# Altium schematic sheet GPS_WS_NEO7M.SchDoc
size 420 x 297 mm; Author: Шафиев Р. И.; CompanyName: HSE; SheetNumber: 1; SheetTotal: 1
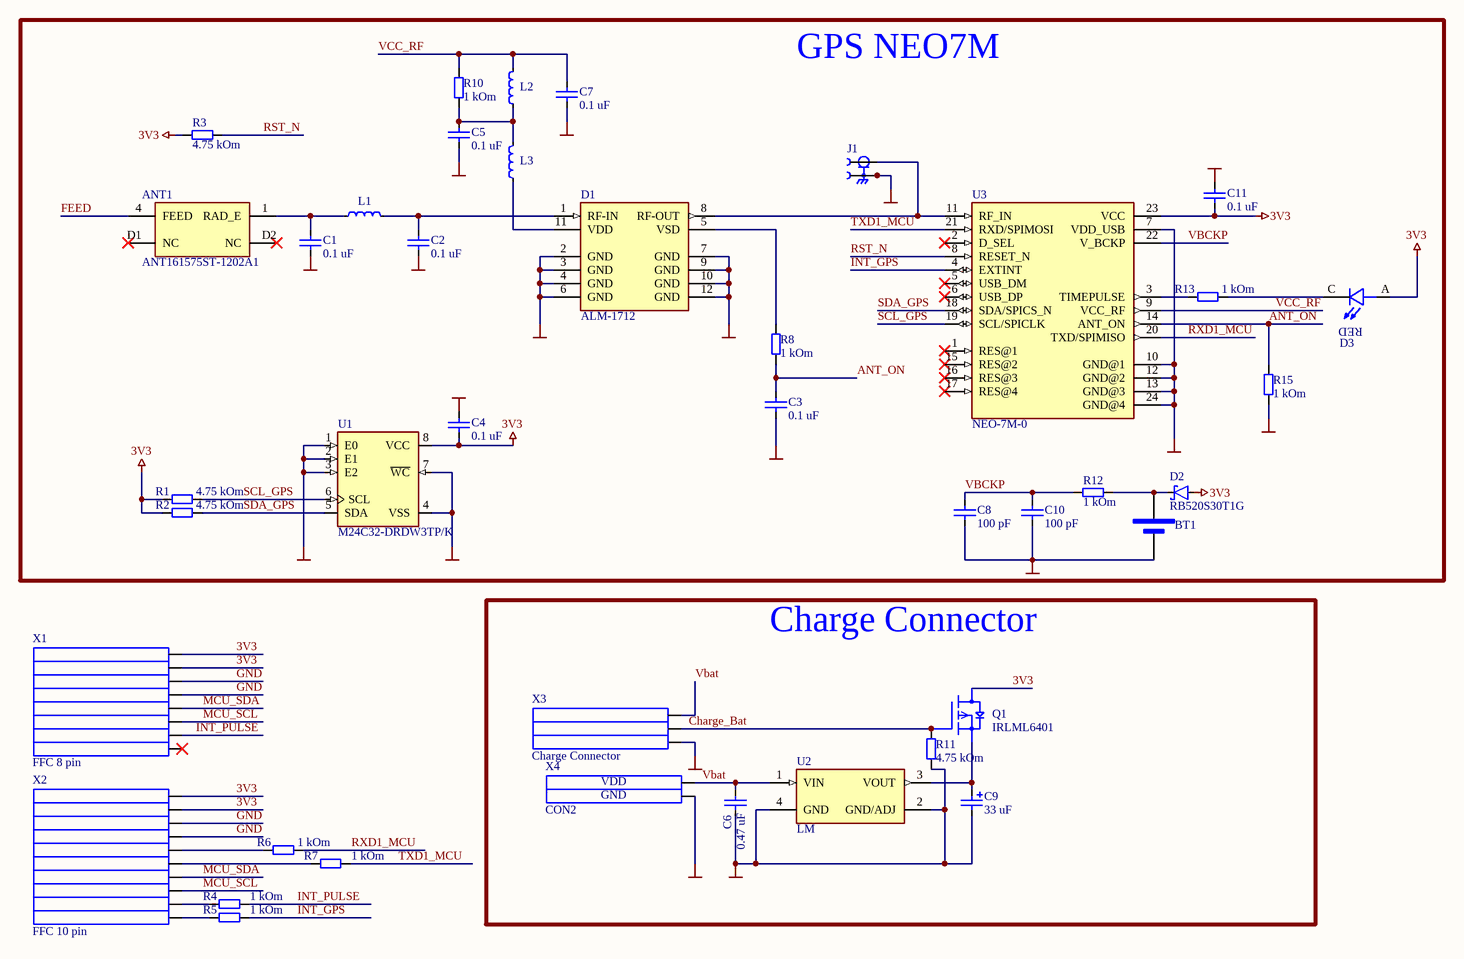
[diagram p0: GPS_WS_NEO7M.SchDoc]

## Parts
ANT1  ANT161575ST-1202A1  [ANT161575ST1202A1]
BT1  ML414H_IV01E  [SEIKO_ML414H_IV01E]  (value not drawn)
C1  value 0.1 uF  [CAPC1005X55N]  (hidden comment: STD_CAP)
C2  value 0.1 uF  [CAPC1005X55N]  (hidden comment: STD_CAP)
C3  value 0.1 uF  [CAPC1005X55N]  (hidden comment: STD_CAP)
C4  value 0.1 uF  [CAPC1005X55N]  (hidden comment: STD_CAP)
C5  value 0.1 uF  [CAPC1005X55N]  (hidden comment: STD_CAP)
C6  value 0.47 uF  [CAPC1608X90N]  (hidden comment: STD_CAP)
C7  value 0.1 uF  [CAPC1608X90N]  (hidden comment: STD_CAP)
C8  value 100 pF  [CAPC1005X55N]  (hidden comment: STD_CAP)
C9  value 33 uF  [CAPMP3216X180N]  (hidden comment: STD_CAP_POL)
C10  value 100 pF  [CAPC1005X55N]  (hidden comment: STD_CAP)
C11  value 0.1 uF  [CAPC1005X55N]  (hidden comment: STD_CAP)
D1  ALM-1712  [ALM-1712]
D2  RB520S30T1G  [SOD523]
D3  7012X1  [LED_7012X1]  (value not drawn)
J1  CONUFL001-SMD  [LINX_CONUFL001-SMD]  (value not drawn)
L1  STD_IND  [RESC1005X40N]  (value not drawn)
L2  STD_IND  [RESC1005X40N]  (value not drawn)
L3  STD_IND  [RESC1005X40N]  (value not drawn)
Q1  IRLML6401  [SOT23]
R1  value 4.75 kOm  [RESC1005X40N]  (hidden comment: 2904)
R2  value 4.75 kOm  [RESC1005X40N]  (hidden comment: 2904)
R3  value 4.75 kOm  [RESC1005X40N]  (hidden comment: 2904)
R4  value 1 kOm  [RESC1005X40N]  (hidden comment: 2839)
R5  value 1 kOm  [RESC1005X40N]  (hidden comment: 2839)
R6  value 1 kOm  [RESC1005X40N]  (hidden comment: 2839)
R7  value 1 kOm  [RESC1005X40N]  (hidden comment: 2839)
R8  value 1 kOm  [RESC1005X40N]  (hidden comment: 2839)
R10  value 1 kOm  [RESC1005X40N]  (hidden comment: 2839)
R11  value 4.75 kOm  [RESC1005X40N]  (hidden comment: 2904)
R12  value 1 kOm  [RESC1005X40N]  (hidden comment: 2839)
R13  value 1 kOm  [RESC1005X40N]  (hidden comment: 2839)
R15  value 1 kOm  [RESC1005X40N]  (hidden comment: 2839)
U1  M24C32-DRDW3TP/K  [SOP65P640X120-8N]
U2  LM  [SOT229P700X180-4N]
U3  NEO-7M-0  [XCVR_NEO-7M-0]
X1  FFC 8 pin  [Charge Connector]
X2  FFC 10 pin  [SAMTEC_ZF5S-10-01-T-WT]
X3  Charge Connector  [POGO PINS]
X4  CON2  [CON2]

## Blocks framed on the sheet
GPS NEO7M: ANT1 BT1 C1-C5 C7 C8 C10 C11 D1-D3 J1 L1-L3 R1-R3 R8 R10 R12 R13 R15 U1 U3
Charge Connector: C6 C9 Q1 R11 U2 X3 X4

## Nets
3V3: C4.2 C11.2 D2.2(A) D3.A Q1.3(D) R1.1 R2.1 R3.2 U1.8(VCC) U3.23(VCC) X1.1 X1.2 X2.1 X2.2
GND: BT1.2(NEG) C1.2 C2.2 C3.2 C4.1 C5.2 C6.2 C7.2 C8.2 C9.2 C10.2 C11.1 D1.2(GND) D1.3(GND) D1.4(GND) D1.6(GND) D1.7(GND) D1.9(GND) D1.10(GND) D1.12(GND) J1.2 J1.3 R11.1 R15.2 U1.1(E0) U1.2(E1) U1.3(E2) U1.4(VSS) U1.7(~{WC}) U2.2(GND/ADJ) U2.4(GND) U3.7(VDD_USB) U3.10(GND@1) U3.12(GND@2) U3.13(GND@3) U3.24(GND@4) X1.3 X1.4 X2.3 X2.4 X3.3 X4.2
ANT_ON: C3.1 R8.2 R15.1 U3.14(ANT_ON)
Charge_Bat: Q1.1(G) R11.2 X3.2
FEED: ANT1.4(FEED)
INT_GPS: R5.2 U3.4(EXTINT)
INT_PULSE: R4.2 X1.7
MCU_SCL: X1.6 X2.8
MCU_SDA: X1.5 X2.7
RST_N: R3.1 U3.8(RESET_N)
RXD1_MCU: R6.1 U3.20(TXD/SPIMISO)
SCL_GPS: R1.2 U1.6(SCL) U3.19(SCL/SPICLK)
SDA_GPS: R2.2 U1.5(SDA) U3.18(SDA/SPICS_N)
TXD1_MCU: R7.2 U3.21(RXD/SPIMOSI)
Vbat: C6.1 U2.1(VIN) X3.1 X4.1
VBCKP: C8.1 C10.1 R12.2 U3.22(V_BCKP)
VCC_RF: C7.1 L2.2 R10.1 U3.9(VCC_RF)
NetANT1_1: ANT1.1(RAD_E) C1.1 L1.1
NetBT1_1: BT1.1(POS) D2.1(K) R12.1
NetC2_1: C2.1 D1.1(RF-IN) L1.2
NetC5_1: C5.1 L2.1 L3.2 R10.2
NetC9_1: C9.1 Q1.2(S) U2.3(VOUT)
NetD1_5: D1.5(VSD) R8.1
NetD1_8: D1.8(RF-OUT) J1.1 U3.11(RF_IN)
NetD1_11: D1.11(VDD) L3.1
NetD3_C: D3.C R13.1
NetR4_1: R4.1 X2.9
NetR5_1: R5.1 X2.10
NetR6_2: R6.2 X2.5
NetR7_1: R7.1 X2.6
NetR13_2: R13.2 U3.3(TIMEPULSE)

Not connected (* = marked no-connect by the designer): ANT1 D1(NC)* D2(NC)*; U3 1(RES@1)* 2(D_SEL)* 5(USB_DM)* 6(USB_DP)* 15(RES@2)* 16(RES@3)* 17(RES@4)*; X1 8*

## Notes on the sheet
- VDD
- GND
- Перв. примен.
- Справ. №
- Подп. и дата
- Инв. № дубл.
- Взам. инв. №
- Изм.
- Лист
- № докум.
- Подп.
- Дата
- Лит.
- Масса
- Масштаб
- Т.контр.
- Разраб.
- Пров.
- Листов
- Инв. № подл.
- Н.контр.
- ООО "Т8 НТЦ"
- Утв.
- Копировал
- Формат А3
- (in symbol 7012X1) RED

## Library data of the parts
ANT1 = ANT161575ST-1202A1: ManufacturerPartnumber: AMAN1003030ST01; Manufacturer: AMOTECH; BOM: GPS Antenna    AMAN1003030ST01 AMOTECH; Human_Readable: GPS Antenna; Footprint_Description: Custom
BT1 = ML414H_IV01E: Coin, 4.8mm 3 V Lithium Battery Rechargeable (Secondary) 1mAh; MP: ML414H IV01E; MF: Seiko Instruments; Human_Readable: Перезаряжаемая батарейка; BOM: Перезаряжаемая батарейка    ML414H IV01E Seiko Instruments; Price: None; Purchase-URL: https://pricing.snapeda.com/search/part/ML414H IV01E/?ref=eda; Package: SOT-89 Seiko; Check_prices: https://www.snapeda.com/parts/ML414H%20IV01E/Seiko+Instruments/view-part/?ref=eda; Value: *; Availability: In Stock; ManufacturerPartnumber: ML414H IV01E; Manufacturer: Seiko Instruments; Footprint_Description: SOT-89 Seiko
C1-C3 C5 = 5571: ManufacturerPartnumber: GRM155R71H104KE14D; Manufacturer: muRata; Number_Base: 5571; Comp_ID: 200003-430; Lib_Description: Capacitor; Comp_Description: Capacitors 0402 0.10 uF ±10% 50V X7R; Human_Readable: Конденсатор 0402 0.1 uF ±10% 50V X7R; Precision: 10%; Temp_Range: -55°C to +125°C; Voltage_Range: 50V; Comp_Class_Number: 200003; Comp_Class_Name: Capacitors Chip SMD 0402; AuthorCreation_Comp: altium_lib_sch_p; AuthorModification_Comp: anosova; BOM: Конденсатор 0402 0.1 uF ±10% 50V X7R    GRM155R71H104KE14D muRata; Dielectric: X7R; HelpURL: \\corp1\RNDlibrary\_Library\Altium_lib\Datasheet\muRata\Chip_Monolithic_Ceramic_Capacitors\c02e.pdf; ComponentLink1Description: MANUFACTURER_URL; ComponentLink1URL: https://www.murata.com/~/media/webrenewal/support/library/catalog/products/capacitor/mlcc/c02e.ashx; Verified: N; TimeCreation_Comp: 05.04.2018 11:21:57; TimeModification_Comp: 18.11.2021 13:11:41; Footprint_Description: Chip Capacitor EIA 0402. METRIC 1005, 2-Leads, Body 1,00x0,5mm, IPC Medium Density
C4 C11 = 5571: ManufacturerPartnumber: GRM155R71H104KE14D; Manufacturer: muRata; Number_Base: 5571; Comp_ID: 200003-430; Lib_Description: Capacitor; Comp_Description: Capacitors 0402 0.10 uF ±10% 50V X7R; Human_Readable: Конденсатор 0402 0.1 uF ±10% 50V X7R; Precision: 10%; Temp_Range: -55°C to +125°C; Voltage_Range: 50V; Dielectric: X7R; Comp_Class_Number: 200003; Comp_Class_Name: Capacitors Chip SMD 0402; AuthorCreation_Comp: altium_lib_sch_p; AuthorModification_Comp: anosova; BOM: Конденсатор 0402 0.1 uF ±10% 50V X7R    GRM155R71H104KE14D muRata; Footprint_Description: Chip Capacitor EIA 0402. METRIC 1005, 2-Leads, Body 1,00x0,5mm, IPC Medium Density; HelpURL: \\corp1\RNDlibrary\_Library\Altium_lib\Datasheet\muRata\Chip_Monolithic_Ceramic_Capacitors\c02e.pdf; ComponentLink1Description: MANUFACTURER_URL; ComponentLink1URL: https://www.murata.com/~/media/webrenewal/support/library/catalog/products/capacitor/mlcc/c02e.ashx; Verified: N; TimeCreation_Comp: 05.04.2018 11:21:57; TimeModification_Comp: 18.11.2021 13:11:41
C6 = 3938: ManufacturerPartnumber: GRM188R71A474KA61D; Manufacturer: muRata; Number_Base: 3938; Comp_ID: 200004-0111; Lib_Description: Capacitor; Comp_Description: Capacitors 0603 0.47 uF ±10% 10V X7R; Human_Readable: Конденсатор 0603 0.47 uF ±10% 10V X7R; Precision: ±10%; Temp_Range: -55 to 125°C; Voltage_Range: 10V; Dielectric: X7R; Comp_Class_Number: 200004; Comp_Class_Name: Capacitors Chip SMD 0603; BOM: Конденсатор 0603 0.47 uF ±10% 10V X7R    GRM188R71A474KA61D muRata; Footprint_Description: Chip Capacitor EIA 0603. METRIC 1608, 2-Leads, Body 1,6x0,8mm, IPC Medium Density; HelpURL: \\corp1\RNDlibrary\_Library\Altium_lib\Datasheet\muRata\Chip_Monolithic_Ceramic_Capacitors\Chip_Monolithic_Ceramic_Capacitors.pdf; ComponentLink1Description: MANUFACTURER_URL; ComponentLink1URL: http://www.murata.com/products/catalog/pdf/c02e.pdf; TimeModification_Comp: 06.12.2011 14:46:17
C7 = 6202: ManufacturerPartnumber: C1608X7R1H104K; Manufacturer: TDK; Number_Base: 6202; Comp_ID: 200004-122; Lib_Description: Capacitor; Comp_Description: Capacitors 0603 0.1 uF ±10% 50V X7R; Precision: ± 10%; Temp_Range: -55°C to +125°C; Voltage_Range: 50 V; Dielectric: X7R; Comp_Class_Number: 200004; Comp_Class_Name: Capacitors Chip SMD 0603; AuthorCreation_Comp: anosova; BOM: Capacitors 0603 0.1 uF ±10% 50V X7R    C1608X7R1H104K TDK; Footprint_Description: Chip Capacitor EIA 0603. METRIC 1608, 2-Leads, Body 1,60x0,8mm, IPC Medium Density; Human_Readable: Capacitors 0603 0.1 uF ±10% 50V X7R; HelpURL: \\corp1\RNDlibrary\_Library\Altium_lib\Datasheet\TDK\Ceramic_Capacitors_C-Series\cseries.pdf; ComponentLink1Description: MANUFACTURER_URL; ComponentLink1URL: https://media.digikey.com/pdf/Data%20Sheets/TDK%20PDFs/C_Series_GeneralAppl_B11.pdf; Verified: N; TimeCreation_Comp: 29.10.2021 11:15:01; AuthorModification_Comp: anosova; TimeModification_Comp: 29.10.2021 11:29:43
C8 C10 = 3764: ManufacturerPartnumber: GRM1555C1H101JA01D; Manufacturer: muRata; Number_Base: 3764; Comp_ID: 200003-0363; Lib_Description: Capacitor; Comp_Description: Capacitors 0402 100 pF ±5% 50V  C0G (NP0); Human_Readable: Конденсатор 0402 100 pF ±5% 50V  C0G (NP0); Precision: ±5%; Temp_Range: 25 to 125°C; Voltage_Range: 50V; Dielectric: C0G (NP0); Comp_Class_Number: 200003; Comp_Class_Name: Capacitors Chip SMD 0402; BOM: Конденсатор 0402 100 pF ±5% 50V  C0G (NP0)    GRM1555C1H101JA01D muRata; AuthorModification_Comp: anosova; Footprint_Description: Chip Capacitor EIA 0402. METRIC 1005, 2-Leads, Body 1,00x0,5mm, IPC Medium Density; HelpURL: \\corp1\RNDlibrary\_Library\Altium_lib\Datasheet\muRata\Chip_Monolithic_Ceramic_Capacitors\Chip_Monolithic_Ceramic_Capacitors.pdf; ComponentLink1Description: MANUFACTURER_URL; ComponentLink1URL: http://www.murata.com/products/catalog/pdf/c02e.pdf; TimeModification_Comp: 18.11.2021 12:51:58; Price: 0,0599999986588955
C9 = 4456: ManufacturerPartnumber: T491A336K010AT; Manufacturer: Kemet; Number_Base: 4456; Comp_ID: 2010-0363; Lib_Description: Polar Capacitor; Comp_Description: Tantal Capacitor Case A  METRIC 3216-18   33 uF 10% 10V; Human_Readable: Конденсатор танталовый корпус A  METRIC 3216-18   33 uF 10% 10V; Precision: 10%; Temp_Range: -55°C to +125°C; Voltage_Range: 10V; Comp_Class_Number: 2010; Comp_Class_Name: Capacitors Tantal; BOM: Конденсатор танталовый корпус A  METRIC 3216-18   33 uF 10% 10V    T491A336K010AT Kemet; Footprint_Description: Tantal Capacitor,Case A, METRIC 3216-18. 2-Leads, Body 3.2x1.6mm, IPC Medium Density; HelpURL: \\corp1\RNDlibrary\_Library\Altium_lib\Datasheet\KEMET\T491\KEM_TC101_STD.pdf; ComponentLink1Description: MANUFACTURER_URL; ComponentLink1URL: http://www.kemet.com/kemet/web/homepage/kechome.nsf/weben/9F2DE33590D9247E8525788D0059B1E1/$file/KEM_TC101_STD.pdf; TimeModification_Comp: 08.12.2011 13:13:16
D1 = ALM-1712: Sot223/Pkg 1-Amp 3.3-Volt Low Drop Out Voltage Regulatator; MF: Advanced Monolithic Systems; MP: AMS1117-3.3; Price: None; Value: *; Availability: Not in stock; Package: SOT-223 Seeed Technology; Check_prices: https://www.snapeda.com/parts/AMS1117-3.3/Advanced+Monolithic+Systems/view-part/?ref=eda; SnapEDA_Link: https://www.snapeda.com/parts/AMS1117-3.3/Advanced+Monolithic+Systems/view-part/?ref=snap
D2 = RB520S30T1G: Diode Schottky 30 V 200mA (DC) Surface Mount SOD-523; Manufacturer: NXP Semiconductors; MP: 1PS79SB70; Human_Readable: Diode Schotky; BOM: Diode Schotky    1PS79SB70 NXP Semiconductors; Package: None; Price: None; Value: *; ManufacturerPartnumber: 1PS79SB70; Footprint_Description: SOD523
D3 = 7012X1: Red - LED Indication - Discrete 1.7V 0805 (2012 Metric); MF: VCC; Package: 0805 Visual Communications; Purchase-URL: https://pricing.snapeda.com/search/part/7012X1/?ref=eda; MP: 7012X1; Value: *; Availability: In Stock; SnapEDA_Link: https://www.snapeda.com/parts/7012X1/Visual+Communications/view-part/?ref=snap; Price: None; Check_prices: https://www.snapeda.com/parts/7012X1/Visual+Communications/view-part/?ref=eda
J1 = CONUFL001-SMD: Manufacturer: TE Connectivity; ManufacturerPartnumber: 1909763-1; BOM: UMCC разъем    1909763-1 TE Connectivity; Human_Readable: UMCC разъем; Availability: In Stock; Price: None; SnapEDA_Link: https://www.snapeda.com/parts/CONUFL001-SMD/Linx/view-part/5842340/?ref=snap; Value: *; Check_prices: https://www.snapeda.com/parts/CONUFL001-SMD/Linx/view-part/5842340/?ref=eda; Package: None; Footprint_Description: UMCC; Parameter 4: *; Parameter 5: *
L1-L3 = 5343: ManufacturerPartnumber: LQW15AN24NG00; Manufacturer: muRata; Value: 24 nH; Number_Base: 5343; Comp_ID: 13010000-030; Lib_Description: RF Inductor wire wound 0402 Size; Precision: ±2%; Temp_Range: -55°C to +125°C; Current_Range: 280 mA; Comp_Class_Number: 13010000; Comp_Class_Name: Inductances Chip; AuthorCreation_Comp: altium_lib_sch_p; BOM: RF Inductor wire wound 0402 Size    LQW15AN24NG00 muRata; Price: 0,239999994635582; Comp_Description: RF Inductor wire wound 0402 Size; Human_Readable: RF Inductor wire wound 0402 Size; HelpURL: \\Corp1\RNDlibrary\_Library\Altium_lib\Datasheet\muRata\Chip_Inductors\Chip_Inductors.o05e.pdf; ComponentLink1Description: MANUFACTURER_URL; Verified: N; TimeCreation_Comp: 10.06.2015 18:13:48; AuthorModification_Comp: altium_lib_sch_p; TimeModification_Comp: 10.06.2015 18:37:11
Q1 = IRLML6401: P-Channel 12V 4.3A (Ta) 1.3W (Ta) Surface Mount Micro3â„¢/SOT-23; Manufacturer: International Rectifier; BOM: P-MOS    IRLML6401 International Rectifier; Human_Readable: P-MOS; Value: *; Check_prices: https://www.snapeda.com/parts/IRLML6401/International%20Rectifier/view-part/557178/?ref=eda; Price: None; SnapEDA_Link: https://www.snapeda.com/parts/IRLML6401/International%20Rectifier/view-part/557178/?ref=snap; Availability: Unavailable; Footprint_Description: SOT-23 International Rectifier; ManufacturerPartnumber: IRLML6401; Parameter 3: *; Parameter 4: *
R1-R3 R11 = 2904: ManufacturerPartnumber: RC0402FR-074K75L; Manufacturer: Yageo; Comp_ID: 11010201-354; Lib_Description: Resistor; Comp_Description: Resistor 0402 1% E96 4.75 kOm; Human_Readable: Резистор 0402 1% E96 4,75 кОм; Precision: 1%; Temp_Range: -55 °C to +155 °C; Power_Range: 0.0625W; Comp_Class_Number: 11010201; Comp_Class_Name: Resistors Chip SMD 0402 1% E96; BOM: Резистор 0402 1% E96 4,75 кОм    RC0402FR-074K75L Yageo; Number_Base: 2904; Footprint_Description: Chip Resistor EIA 0402. METRIC 1005, 2-Leads, Body 1,00x0,5mm, IPC Medium Density; HelpURL: \\corp1\RNDlibrary\_Library\Altium_lib\Datasheet\Yageo\RC0402\PYu-RC0402_51_RoHS_L_6.pdf; ComponentLink1Description: MANUFACTURER_URL; ComponentLink1URL: http://www.yageo.com/documents/recent/PYu-RC0402_51_RoHS_L_6.pdf; Price: 0,00600000005215406; TimeModification_Comp: 06.12.2011 13:34:56
R4-R8 R10 R12 R13 R15 = 2839: ManufacturerPartnumber: RC0402FR-071K00L; Manufacturer: Yageo; Comp_ID: 11010201-289; Lib_Description: Resistor; Comp_Description: Resistor 0402 1% E96 1 kOm; Human_Readable: Резистор 0402 1% E96 1 кОм; Precision: 1%; Temp_Range: -55 °C to +155 °C; Power_Range: 0.0625W; Comp_Class_Number: 11010201; Comp_Class_Name: Resistors Chip SMD 0402 1% E96; BOM: Резистор 0402 1% E96 1 кОм    RC0402FR-071K00L Yageo; Number_Base: 2839; Footprint_Description: Chip Resistor EIA 0402. METRIC 1005, 2-Leads, Body 1,00x0,5mm, IPC Medium Density; HelpURL: \\corp1\RNDlibrary\_Library\Altium_lib\Datasheet\Yageo\RC0402\PYu-RC0402_51_RoHS_L_6.pdf; ComponentLink1Description: MANUFACTURER_URL; ComponentLink1URL: http://www.yageo.com/documents/recent/PYu-RC0402_51_RoHS_L_6.pdf; Price: 0,00600000005215406; TimeModification_Comp: 06.12.2011 13:34:56
U1 = M24C32-DRDW3TP/K: M24C02-F Series 2 Kb (256 x 8) 5.5 V Serial IÂ²C bus EEPROMs - TSSOP-8; Manufacturer: STMicroelectronics; BOM: EEPROM    M24C32-DRDW3TP/K STMicroelectronics; Human_Readable: EEPROM; Package: None; Price: None; Value: *; Availability: Unavailable; ManufacturerPartnumber: M24C32-DRDW3TP/K; Footprint_Description: TSSOP8
U2 = LM: Sot223/Pkg 1-Amp 3.3-Volt Low Drop Out Voltage Regulatator; ManufacturerPartnumber: LM3940IMP-3.3; Manufacturer: Texas Instruments; MF: Advanced Monolithic Systems; MP: AMS1117-3.3; BOM: LDO    LM3940IMP-3.3 Texas Instruments; Human_Readable: LDO; Value: *; Check_prices: https://www.snapeda.com/parts/AMS1117-3.3/Advanced+Monolithic+Systems/view-part/?ref=eda; Price: None; Availability: Not in stock; SnapEDA_Link: https://www.snapeda.com/parts/AMS1117-3.3/Advanced+Monolithic+Systems/view-part/?ref=snap; Footprint_Description: SOT-223 Seeed Technology
U3 = NEO-7M-0: NEO-7 RF Receiver GLONASS, GNSS, GPS 1.575GHz -161dBm; MF: U-Blox America; BOM: NEO-7M-0 U-Blox America; Availability: Unavailable; MP: NEO-7M-0; Package: SMD-24 u-blox; SnapEDA_Link: https://www.snapeda.com/parts/NEO-7M-0/U-Blox%20America%20Inc./view-part/48598/?ref=snap; Value: *; ManufacturerPartnumber: NEO-7M-0; Manufacturer: U-Blox America; Footprint_Description: SMD-24 u-blox
X1 = FFC 8 pin: FFC connector 8 pin
X2 = FFC 10 pin: FFC connector 8 pin
X3 = Charge Connector: Выводы под плату зарядки
X4 = CON2: Коннектор двухконтактный; ManufacturerPartnumber: LP401230; Manufacturer: Robiton; BOM: Аккумулятор литий ионный    LP401230 Robiton; Human_Readable: Аккумулятор литий ионный; Footprint_Description: Custom